# EAGLE design curveTracerRev4 (EAGLE 9.1.3)
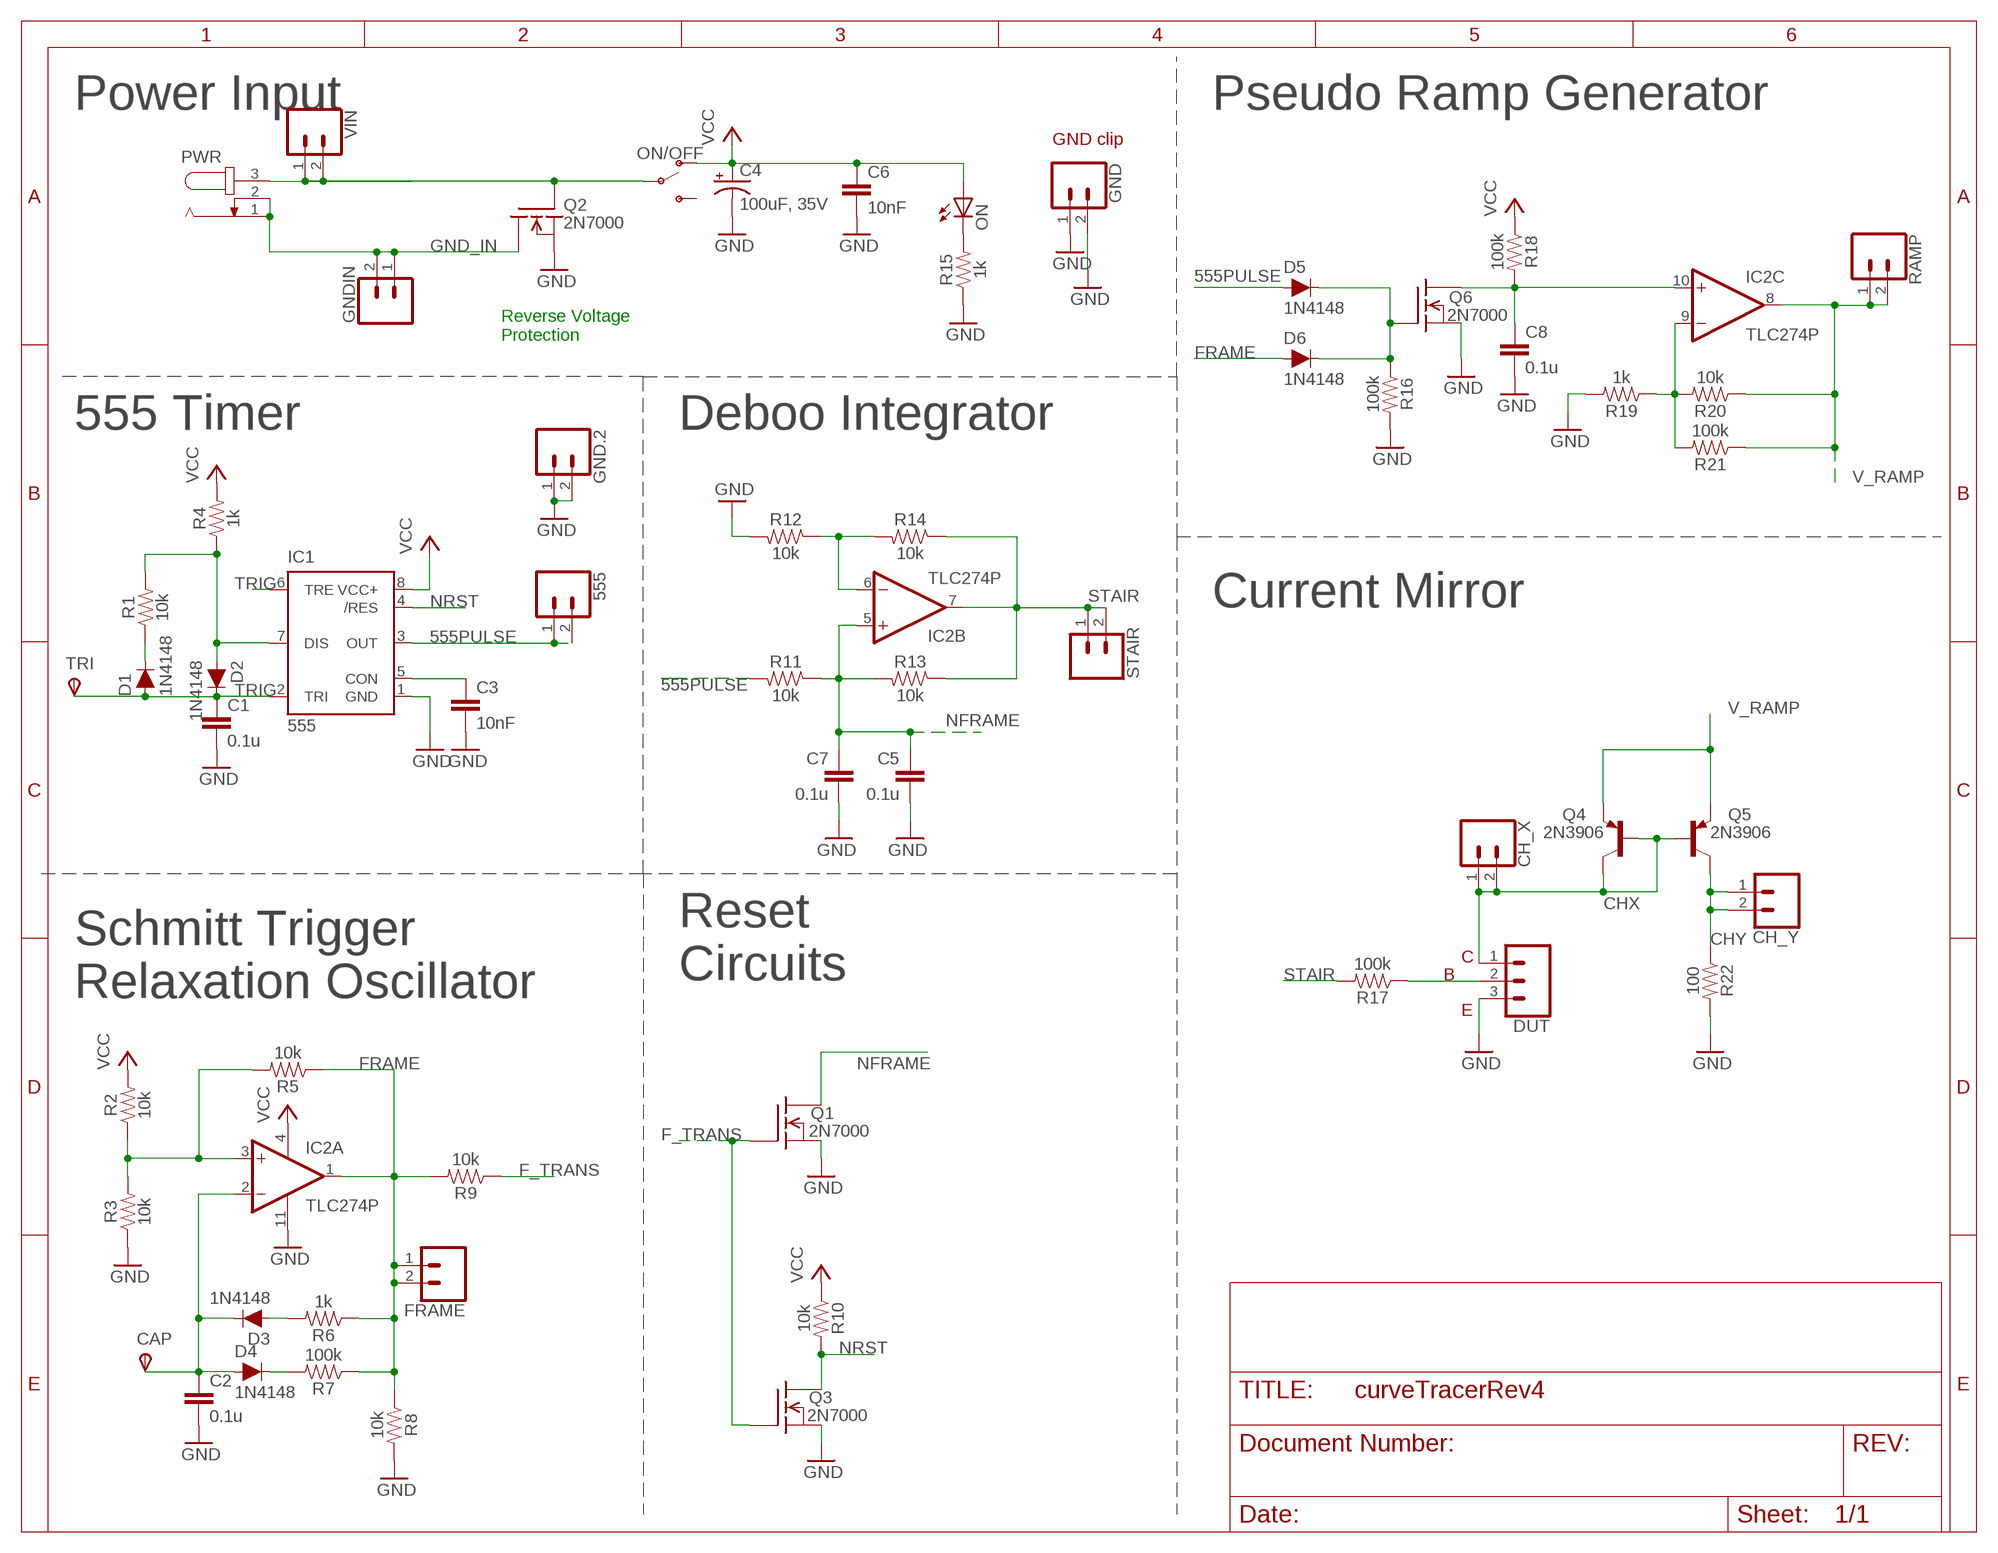
[diagram p0: schematic, sheet 1]

## Parts
555  CONN_02  [1X02]
C1  0.1u  C-EU050-024X044  [C050-024X044]
C2  0.1u  C-EU050-024X044  [C050-024X044]
C3  10nF  C-EU050-024X044  [C050-024X044]
C4  100uF, 35V  CPOL-USE2.5-6  [E2,5-6]
C5  0.1u  C-EU050-024X044  [C050-024X044]
C6  10nF  C-EU050-024X044  [C050-024X044]
C7  0.1u  C-EU050-024X044  [C050-024X044]
C8  0.1u  C-EU050-024X044  [C050-024X044]
CAP  TPSPAD1-13Y  [P1-13Y]
CH_X  CONN_02  [1X02]
CH_Y  CONN_02  [1X02]
D1  1N4148  DIODE-1N4148  [DIODE-1N4148]
D2  1N4148  DIODE-1N4148  [DIODE-1N4148]
D3  1N4148  DIODE-1N4148  [DIODE-1N4148]
D4  1N4148  DIODE-1N4148  [DIODE-1N4148]
D5  1N4148  DIODE-1N4148  [DIODE-1N4148]
D6  1N4148  DIODE-1N4148  [DIODE-1N4148]
DUT  CONN_03LOCK_LONGPADS  [1X03_LOCK_LONGPADS]
FRAME  CONN_02  [1X02]
GND  CONN_02  [1X02]
GND.2  CONN_02  [1X02]
GNDIN  CONN_02  [1X02]
IC1  555  555P  [DIP08]
IC2  TLC274P  [DIL14]
ON  LED5MM  [LED5MM]
ON/OFF  SWITCH-SPDT-PTH-11.6X4.0MM  [SWITCH_SPDT_PTH_11.6X4.0MM]
PWR  JACK-PLUG0  [SPC4077]
Q1  2N7000  TN0602N3  [TO-92]
Q2  2N7000  TN0602N3  [TO-92]
Q3  2N7000  TN0602N3  [TO-92]
Q4  2N3906  [TO92]
Q5  2N3906  [TO92]
Q6  2N7000  TN0602N3  [TO-92]
R1  10k  RESISTORAXIAL-0.3  [AXIAL-0.3]
R2  10k  RESISTORAXIAL-0.3  [AXIAL-0.3]
R3  10k  RESISTORAXIAL-0.3  [AXIAL-0.3]
R4  1k  RESISTORAXIAL-0.3  [AXIAL-0.3]
R5  10k  RESISTORAXIAL-0.3  [AXIAL-0.3]
R6  1k  RESISTORAXIAL-0.3  [AXIAL-0.3]
R7  100k  RESISTORAXIAL-0.3  [AXIAL-0.3]
R8  10k  RESISTORAXIAL-0.3  [AXIAL-0.3]
R9  10k  RESISTORAXIAL-0.3  [AXIAL-0.3]
R10  10k  RESISTORAXIAL-0.3  [AXIAL-0.3]
R11  10k  RESISTORAXIAL-0.3  [AXIAL-0.3]
R12  10k  RESISTORAXIAL-0.3  [AXIAL-0.3]
R13  10k  RESISTORAXIAL-0.3  [AXIAL-0.3]
R14  10k  RESISTORAXIAL-0.3  [AXIAL-0.3]
R15  1k  RESISTORAXIAL-0.3  [AXIAL-0.3]
R16  100k  RESISTORAXIAL-0.3  [AXIAL-0.3]
R17  100k  RESISTORAXIAL-0.3  [AXIAL-0.3]
R18  100k  RESISTORAXIAL-0.3  [AXIAL-0.3]
R19  1k  RESISTORAXIAL-0.3  [AXIAL-0.3]
R20  10k  RESISTORAXIAL-0.3  [AXIAL-0.3]
R21  100k  RESISTORAXIAL-0.3  [AXIAL-0.3]
R22  100  RESISTORAXIAL-0.3  [AXIAL-0.3]
RAMP  CONN_02  [1X02]
STAIR  CONN_02  [1X02]
TRI  TPSPAD1-13Y  [P1-13Y]
VIN  CONN_02  [1X02]

## Nets
555PULSE: 555.1 555.2 D5.A IC1.3(OUT) R11.P$2
CHX: CH_X.1 CH_X.2 DUT.1 Q4.1(C) Q4.2(B) Q5.2(B)
CHY: CH_Y.1 CH_Y.2 Q5.1(C) R22.P$1
F_TRANS: Q1.2(G) Q3.2(G) R9.P$1
FRAME: D6.A FRAME.1 FRAME.2 IC2.1(A:OUT) R5.P$1 R6.P$1 R7.P$1 R8.P$1 R9.P$2
GND: C1.2 C2.2 C3.2 C4.- C5.2 C6.2 C7.2 C8.2 DUT.3 GND.1 GND.2 GND.2.1 GND.2.2 IC1.1(GND) IC2.11(P:V-) Q1.1(S) Q2.1(S) Q3.1(S) Q6.1(S) R3.P$1 R8.P$2 R12.P$2 R15.P$1 R16.P$2 R19.P$2 R22.P$2
GND_IN: GNDIN.1 GNDIN.2 PWR.1 PWR.2 Q2.3(D)
N$1: ON/OFF.2(P) PWR.3 Q2.2(G) VIN.1 VIN.2
N$2: ON.K(C) R15.P$2
N$3: D1.C R1.P$1
N$5: D2.A IC1.7(DIS) R1.P$2 R4.P$1
N$6: D3.A R6.P$2
N$7: C3.1 IC1.5(CON)
N$8: C2.1 CAP.TP(PP) D3.C D4.A IC2.2(A:-IN)
N$9: IC2.3(A:+IN) R2.P$1 R3.P$2 R5.P$2
N$10: D4.C R7.P$2
N$12: D5.C D6.C Q6.2(G) R16.P$1
N$13: DUT.2 R17.P$1
N$15: IC2.6(B:-IN) R12.P$1 R14.P$2
N$16: IC2.9(C:-IN) R19.P$1 R20.P$2 R21.P$2
N$18: C8.1 IC2.10(C:+IN) Q6.3(D) R18.P$2
NFRAME: C5.1 C7.1 IC2.5(B:+IN) Q1.3(D) R11.P$1 R13.P$2
NRST: IC1.4(/RES) Q3.3(D) R10.P$2
STAIR: IC2.7(B:OUT) R13.P$1 R14.P$1 R17.P$2 STAIR.1 STAIR.2
TRIG: C1.1 D1.A D2.C IC1.2(TRI) IC1.6(TRE) TRI.TP(PP)
V_RAMP: IC2.8(C:OUT) Q4.3(E) Q5.3(E) R20.P$1 R21.P$1 RAMP.1 RAMP.2
VCC: C4.+ C6.1 IC1.8(VCC+) IC2.4(P:V+) ON.A ON/OFF.1(O) R2.P$2 R4.P$2 R10.P$1 R18.P$1
Unconnected: IC2.12(D:+IN) IC2.13(D:-IN) IC2.14(D:OUT) ON/OFF.3(S)

## Notes on the sheet
- Power Input | Pseudo Ramp Generator
- GND clip
- Reverse Voltage 
  Protection
- 555 Timer | Deboo Integrator
- Current Mirror
- C
- Reset 
  Circuits
- B
- Schmitt Trigger 
  Relaxation Oscillator
- E

## Library data of the parts
555 CH_X CH_Y FRAME GND GND.2 GNDIN RAMP STAIR VIN = SparkFun-Connectors:CONN_02: Multi connection point. Often used as Generic Header-pin footprint for 0.1 inch spaced/style header connections On any of the 0.1 inch spaced packages, you can populate with these: Break Away Headers - Straight <https://www.sparkfun.com/products/116> (PRT-00116) Break Away Male Headers - Right Angle <https://www.sparkfun.com/products/553> (PRT-00553) Female Headers <https://www.sparkfun.com/products/115> (PRT-00115) Break Away Headers - Machine Pin <https://www.sparkfun.com/products/117> (PRT-00117) Break Away Female Headers - Swiss Machine Pin <https://www.sparkfun.com/products/743> (PRT-00743) For SCREWTERMINALS and SPRING TERMINALS visit here: Screw Terimnals on SparkFun.com <https://www.sparkfun.com/search/results?term=Screw+Terminals> (5mm/3.5mm/2.54mm spacing) This device is also useful as a general connection point to wire up your design to another part of your project. Our various solder wires solder well into these plated through hole pads. Hook-Up Wire - Assortment (Stranded, 22 AWG) <https://www.sparkfun.com/products/11375> (PRT-11375) Hook-Up Wire - Assortment (Solid Core, 22 AWG) <https://www.sparkfun.com/products/11367> (PRT-11367) View the entire wire category on our website here <https://www.sparkfun.com/categories/141> Special notes: Molex polarized connector foot print use with: PRT-08233 with associated crimp pins and housings. 2.54_SCREWTERM for use with PRT-10571. 3.5mm Screw Terminal footprints for PRT-08084 5mm Screw Terminal footprints for use with PRT-08432
C1-C3 C5-C8 = rcl:C-EU: CAPACITOR, European symbol; SPICEPREFIX: C
C4 = rcl:CPOL-US: POLARIZED CAPACITOR, American symbol; SPICEPREFIX: C
CAP TRI = testpad:TPS: TEST PIN
D1-D6 = SparkFun-DiscreteSemi:DIODE: Diode These are standard reverse protection diodes and small signal diodes. SparkFun Products: SparkFun SparkPunk Sound Kit <https://www.sparkfun.com/products/11177> SparkFun ESP8266 Thing <https://www.sparkfun.com/products/13231>; PROD_ID: DIO-08378; VALUE: 200mA/100V/1V
DUT = SparkFun-Connectors:CONN_03: Multi connection point. Often used as Generic Header-pin footprint for 0.1 inch spaced/style header connections On any of the 0.1 inch spaced packages, you can populate with these: Break Away Headers - Straight <https://www.sparkfun.com/products/116> (PRT-00116) Break Away Male Headers - Right Angle <https://www.sparkfun.com/products/553> (PRT-00553) Female Headers <https://www.sparkfun.com/products/115> (PRT-00115) Break Away Headers - Machine Pin <https://www.sparkfun.com/products/117> (PRT-00117) Break Away Female Headers - Swiss Machine Pin <https://www.sparkfun.com/products/743> (PRT-00743) Stackable Header - 3 Pin (Female, 0.1") <https://www.sparkfun.com/products/13875> (PRT-13875) For SCREWTERMINALS and SPRING TERMINALS visit here: Screw Terimnals on SparkFun.com <https://www.sparkfun.com/search/results?term=Screw+Terminals> (5mm/3.5mm/2.54mm spacing) This device is also useful as a general connection point to wire up your design to another part of your project. Our various solder wires solder well into these plated through hole pads. Hook-Up Wire - Assortment (Stranded, 22 AWG) <https://www.sparkfun.com/products/11375> (PRT-11375) Hook-Up Wire - Assortment (Solid Core, 22 AWG) <https://www.sparkfun.com/products/11367> (PRT-11367) View the entire wire category on our website here <https://www.sparkfun.com/categories/141> Special notes: Molex polarized connector foot print use with SKU : PRT-08232 with associated crimp pins and housings.
IC1 = SparkFun-IC-Special-Function:555: General purpose bipolar Timer Datasheet <http://www.sparkfun.com/datasheets/Components/General/ne555.pdf> SparkFun Products SparkFun SparkPunk Sequencer Kit <https://www.sparkfun.com/products/12707> (KIT-12707) Storefront Component: 555 Timer <https://www.sparkfun.com/products/9273> (COM-09273) Two parts valid for production: VFP: IC-11930 (M7555 PTH) VFP: IC-09173 (555 PTH) - Preferred; PROD_ID: IC-09173; PROD_ID_ALT: IC-09173
IC2 = linear:TLC274: OP AMP
ON = led:LED: LED OSRAM: - CHIPLED LG R971, LG N971, LY N971, LG Q971, LY Q971, LO R971, LY R971 LH N974, LH R974 LS Q976, LO Q976, LY Q976 LO Q996 - Hyper CHIPLED LW Q18S LB Q993, LB Q99A, LB R99A - SideLED LS A670, LO A670, LY A670, LG A670, LP A670 LB A673, LV A673, LT A673, LW A673 LH A674 LY A675 LS A676, LA A676, LO A676, LY A676, LW A676 LS A679, LY A679, LG A679 - Hyper Micro SIDELED® LS Y876, LA Y876, LO Y876, LY Y876 LT Y87S - SmartLED LW L88C, LW L88S LB L89C, LB L89S, LG L890 LS L89K, LO L89K, LY L89K LS L896, LA L896, LO L896, LY L896 - TOPLED LS T670, LO T670, LY T670, LG T670, LP T670 LSG T670, LSP T670, LSY T670, LOP T670, LYG T670 LG T671, LOG T671, LSG T671 LB T673, LV T673, LT T673, LW T673 LH T674 LS T676, LA T676, LO T676, LY T676, LB T676, LH T676, LSB T676, LW T676 LB T67C, LV T67C, LT T67C, LS T67K, LO T67K, LY T67K, LW E67C LS E67B, LA E67B, LO E67B, LY E67B, LB E67C, LV E67C, LT E67C LW T67C LS T679, LY T679, LG T679 LS T770, LO T770, LY T770, LG T770, LP T770 LB T773, LV T773, LT T773, LW T773 LH T774 LS E675, LA E675, LY E675, LS T675 LS T776, LA T776, LO T776, LY T776, LB T776 LHGB T686 LT T68C, LB T68C - Hyper Mini TOPLED® LB M676 - Mini TOPLED Santana® LG M470 LS M47K, LO M47K, LY M47K Source: http://www.osram.convergy.de LUXEON: - LUMILED® LXK2-PW12-R00, LXK2-PW12-S00, LXK2-PW14-U00, LXK2-PW14-V00 LXK2-PM12-R00, LXK2-PM12-S00, LXK2-PM14-U00 LXK2-PE12-Q00, LXK2-PE12-R00, LXK2-PE12-S00, LXK2-PE14-T00, LXK2-PE14-U00 LXK2-PB12-K00, LXK2-PB12-L00, LXK2-PB12-M00, LXK2-PB14-N00, LXK2-PB14-P00, LXK2-PB14-Q00 LXK2-PR12-L00, LXK2-PR12-M00, LXK2-PR14-Q00, LXK2-PR14-R00 LXK2-PD12-Q00, LXK2-PD12-R00, LXK2-PD12-S00 LXK2-PH12-R00, LXK2-PH12-S00 LXK2-PL12-P00, LXK2-PL12-Q00, LXK2-PL12-R00 Source: www.luxeon.com KINGBRIGHT: KA-3528ASYC Source: www.kingbright.com
ON/OFF = SparkFun-Switches:SWITCH-SPDT: Single Pole, Double Throw (SPDT) Switch Single-pole, double-throw (SPDT) switch. Variant Overview SMD-AYZ0202 Surface Mount DPDT Switch <https://www.sparkfun.com/products/597> (COM-00597) Used on e.g. LilyPad Arduino USB - ATmega32U4 Board <https://www.sparkfun.com/products/12049> PTH-11.6X4.0MM SPDT Mini Power Switch <https://www.sparkfun.com/products/102> (COM-00102) Used on e.g. SparkFun Simon Says - Through-Hole Soldering Kit <https://www.sparkfun.com/products/10547> (KIT-10547) PTH-11.6X4.0MM-KIT KIT version of SPDT Mini Power Switch - Simplifies soldering by removing tStop of switch pins - only one side can be soldered. PTH-11.6X4.0MM-LOCK LOCK version of SPDT Mini Power Switch - Offset pins hold switch in place for easier soldering. SMD-RIGHT-ANGLE Surface Mount Right Angle Switch <https://www.sparkfun.com/products/10860> (COM-10860) Used on e.g. SparkFun ESP8266 Thing <https://www.sparkfun.com/products/13231>; PROD_ID: SWCH-08261; SF_SKU: COM-00102
PWR = con-jack:JACK-PLUG: DC POWER JACK Power Jack, DC, Right Angle, Through Hole, Rated 5A at 16VDC, PC Terminals Distributor: Farnell (www.Farnell.de) Drawing: 84N1161.pdf / 84N1162.pdf Manufacturer: SPC Technology (www.spctechnology.com) Type: SPC4077 / SPC 4078; OC_FARNELL: unknown; OC_NEWARK: unknown
Q1-Q3 Q6 = transistor-fet:TN0602N3: N-Channel Enhancement MOSFET 20V; 4A; 0,75Ohm
Q4 Q5 = transistor-pnp:2N3906: PNP Transistor
R1-R22 = SparkFun-Resistors:RESISTOR: Generic Resistor Package

## Board
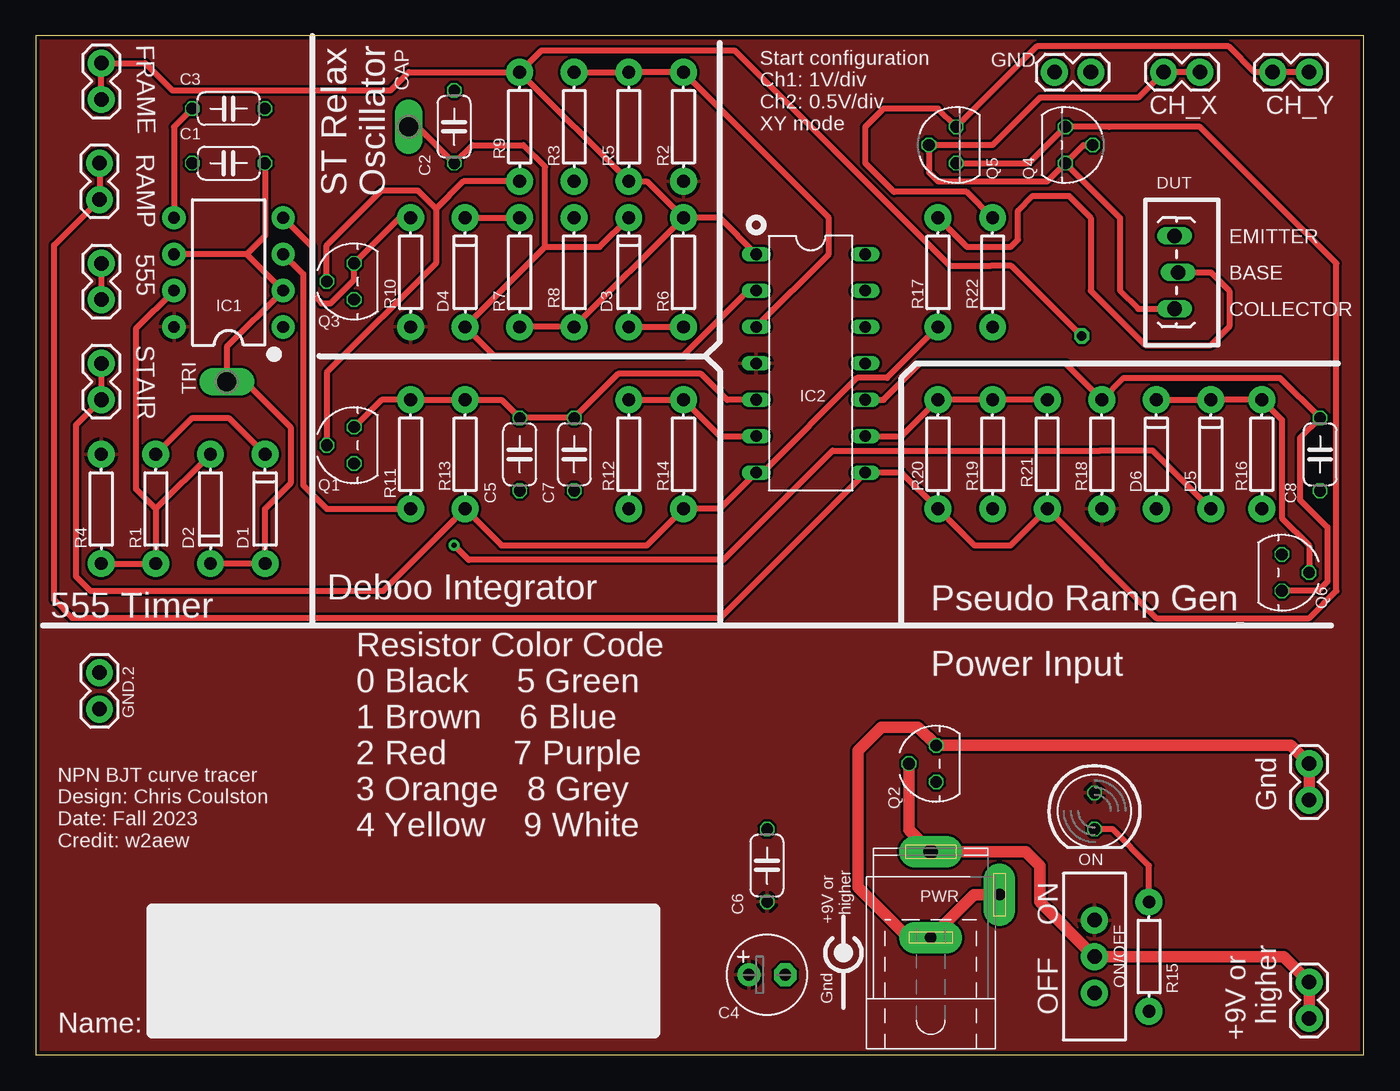
[diagram p1: board, top side]
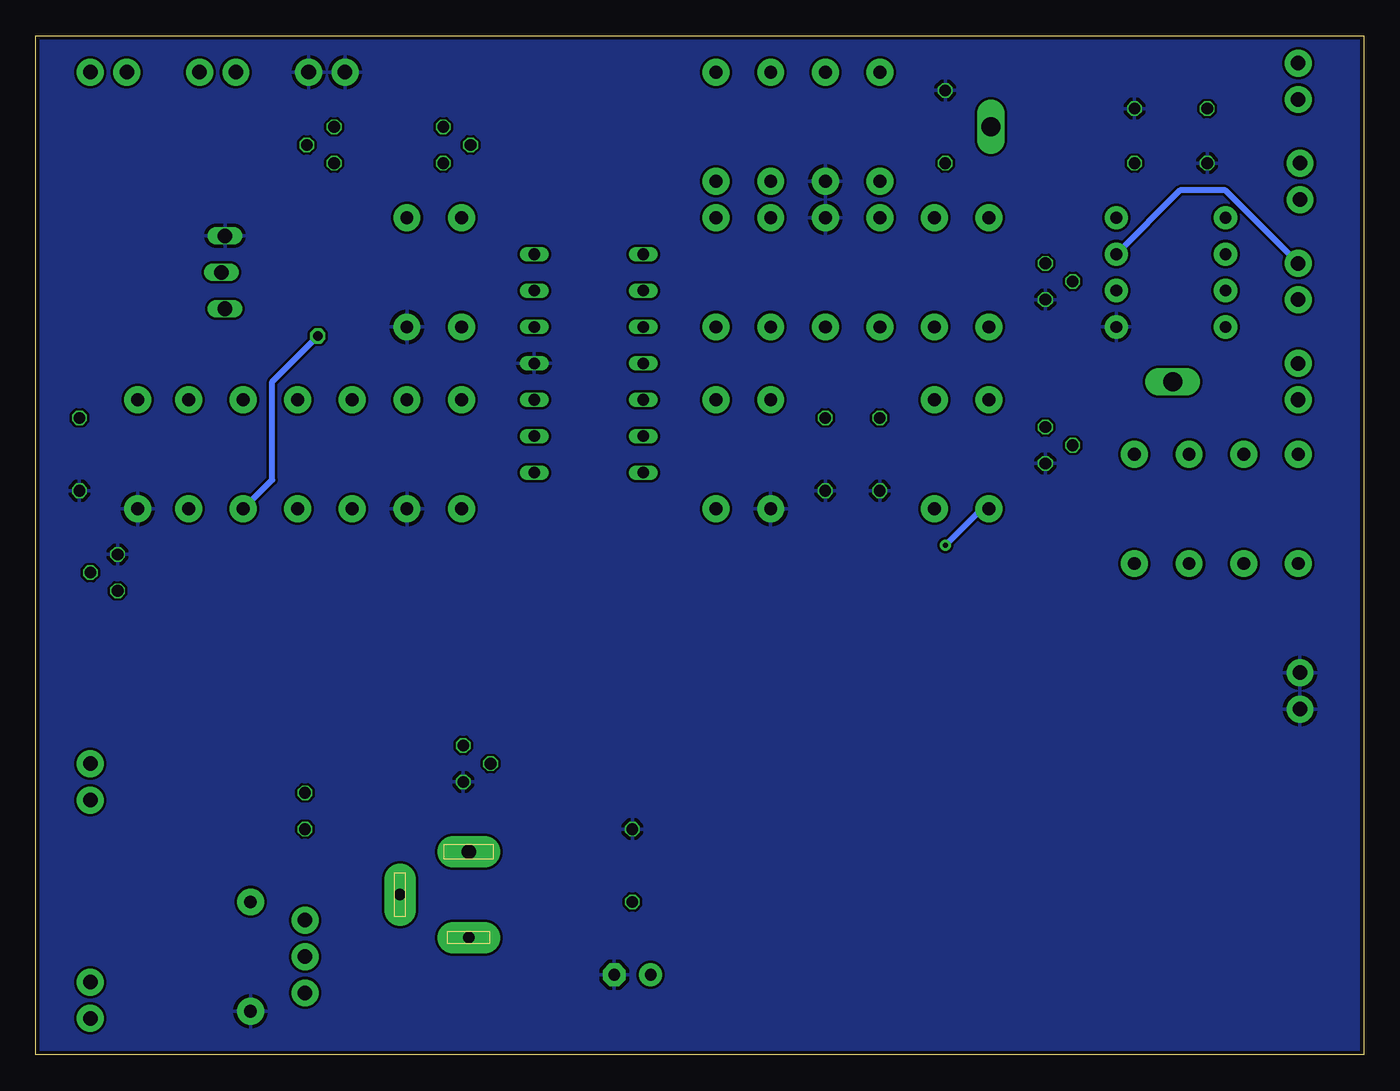
[diagram p2: board, bottom side, seen from below]

Size 92.71 x 71.12 mm. Coordinates in mm from the lower left corner, seen from the top.
Outline: 0,0 92.71,0 92.71,71.12 0,71.12 0,0
Copper layers (1*16): Top 0.0356mm / dielectric 1.5011mm / Bottom 0.0356mm
Design rules "SilverCircuits": minimum track width 7mil, minimum drill 10mil, track to track 7mil, track to pad 7mil, pad to pad 7mil, via to via 7mil, smd to smd 0mil, copper to edge 10mil, drill to drill 10mil, minimum pad ring 4mil, minimum via ring 8mil, stop-mask expansion 4mil, vias tented up to drill 0mil, thermal gap 10mil

### Footprints (pad centres in the part's own frame; a part is rotated, then mirrored left to right if it is on the bottom)
1X02 = drill 1.016 pad 1.88: 1 0,0; 2 2.54,0
C050-024X044 = drill 0.813 octagon: 1 -2.54,0; 2 2.54,0
E2,5-6 = drill 0.813 pad 1.6: + -1.27,0 | drill 0.813 pad 1.6 octagon: - 1.27,0
P1-13Y = drill 1.321 pad 1.905 long: TP 0,0
DIODE-1N4148 = drill 0.9 pad 1.88: A -3.81,0; C 3.81,0
1X03_LOCK_LONGPADS = drill 1.016 long: 1 0,0; 2 2.54,-0.254; 3 5.08,0
DIP08 = drill 0.813 pad 1.626: 1 -3.81,-3.81; 2 -1.27,-3.81; 3 1.27,-3.81; 4 3.81,-3.81; 5 3.81,3.81; 6 1.27,3.81; 7 -1.27,3.81; 8 -3.81,3.81
DIL14 = drill 0.813 long: 1 -7.62,-3.81; 2 -5.08,-3.81; 3 -2.54,-3.81; 4 0,-3.81; 5 2.54,-3.81; 6 5.08,-3.81; 7 7.62,-3.81; 8 7.62,3.81; 9 5.08,3.81; 10 2.54,3.81; 11 0,3.81; 12 -2.54,3.81; 13 -5.08,3.81; 14 -7.62,3.81
LED5MM = drill 0.813 octagon: A -1.27,0; K 1.27,0
SWITCH_SPDT_PTH_11.6X4.0MM = drill 1.016 pad 1.88: 1 0,2.54; 2 0,0; 3 0,-2.54
SPC4077 = drill 0.8 pad 2.184 long: 1 -3,0; 2 0,-4.8 | drill 1 pad 2.184 long: 3 3,0
TO-92 = drill 0.813 octagon: 1 -1.27,0; 2 0,1.905; 3 1.27,0
TO92 = drill 0.813 octagon: 1 1.27,0; 2 0,1.905; 3 -1.27,0
AXIAL-0.3 = drill 0.9 pad 1.88: P$1 -3.81,0; P$2 3.81,0

### Placement (x,y rotation side)
555  4.57,52.7 90 top
C1  13.46,62.23 180 top
C2  29.21,64.77 90 top
C3  13.46,66.04 0 top
C4  51.05,5.59 0 top
C5  33.78,41.91 270 top
C6  51.05,13.21 90 top
C7  37.59,41.91 270 top
C8  89.66,41.91 270 top
CAP  26.04,64.77 0 top
CH_X  78.74,68.58 0 top
CH_Y  86.36,68.58 0 top
D1  16,38.1 90 top
D2  12.19,38.1 270 top
D3  41.4,54.61 90 top
D4  29.97,54.61 90 top
D5  82.04,41.91 90 top
D6  78.23,41.91 90 top
DUT  79.5,52.07 90 top
FRAME  4.57,66.67 90 top
GND  71.12,68.58 0 top
GND.2  4.45,26.67 270 top
GNDIN  88.9,17.78 90 top
IC1  13.46,54.61 90 top
IC2  54.1,48.26 270 top
ON  73.91,17.02 270 top
ON/OFF  73.91,6.86 0 top
PWR  62.48,11.18 90 top
Q1  22.23,42.55 90 top
Q2  62.87,20.32 90 top
Q3  22.23,53.98 90 top
Q4  71.88,63.5 270 top
Q5  64.26,63.5 90 top
Q6  87,33.66 270 top
R1  8.38,38.1 270 top
R2  45.21,64.77 270 top
R3  37.59,64.77 90 top
R4  4.57,38.1 90 top
R5  41.4,64.77 90 top
R6  45.21,54.61 270 top
R7  33.78,54.61 90 top
R8  37.59,54.61 90 top
R9  33.78,64.77 90 top
R10  26.16,54.61 90 top
R11  26.16,41.91 270 top
R12  41.4,41.91 270 top
R13  29.97,41.91 90 top
R14  45.21,41.91 90 top
R15  77.72,6.86 90 top
R16  85.6,41.91 270 top
R17  62.99,54.61 270 top
R18  74.42,41.91 90 top
R19  66.8,41.91 270 top
R20  62.99,41.91 90 top
R21  70.61,41.91 90 top
R22  66.8,54.61 270 top
RAMP  4.45,62.23 270 top
STAIR  4.57,45.72 90 top
TRI  13.34,46.99 90 top
VIN  88.9,2.54 90 top

### Tracks (layer width: path | path; a pad name or v marks a point on that pad's centre or on a via)
555PULSE  (via drill 0.35)
  Top 0.406: v29.21,35.56 30.23,34.54 48.01,34.54 55.63,42.16 74.3,42.16 77.98,42.16 D5.A | 555.2 555.1 | R11.P$2 20.32,38.1 18.67,39.75 18.67,54.48 IC1.3
  Bottom 0.406: v29.21,35.56 26.67,38.1 R11.P$2 | 555.2 9.65,60.33 12.83,60.33 IC1.3
CHX
  Top 0.406: Q4.1 75.69,58.42 75.69,53.34 76.96,52.07 DUT.1 | Q4.1 73.15,63.5 Q4.2 | Q4.1 70.61,60.96 62.99,60.96 62.36,61.59 Q5.2 66.8,63.5 70.1,66.8 76.96,66.8 CH_X.1 CH_X.2
CHY
  Top 0.406: R22.P$1 65,60.22 59.92,60.22 57.91,62.23 57.91,64.77 59.18,66.04 62.99,66.04 Q5.1 69.88,70.38 83.29,70.38 85.09,68.58 CH_Y.1 CH_Y.2
F_TRANS
  Top 0.406: R9.P$1 29.84,60.96 27.94,59.05 | 27.94,59.05 26.67,60.33 24.13,60.33 20.32,56.52 Q3.2 | Q1.2 20.32,47.62 27.94,55.24 27.94,59.05
FRAME  (via drill 0.65)
  Top 0.406: IC2.1 47.75,58.42 R6.P$1 | R6.P$1 42.67,60.96 R5.P$1 R9.P$2 | R7.P$1 R8.P$1 R6.P$1 | FRAME.1 FRAME.2 7.62,69.22 9.53,67.31 24.77,67.31 26.04,68.58 R9.P$2 | R9.P$2 35.31,70.1 48.77,70.1 63.8,55.07 66.67,55.07 68.12,55.07 v73.03,50.16
  Bottom 0.406: D6.A 76.2,40.13 76.2,46.99 v73.03,50.16
GND
  pour Bottom: 0,0 92.71,0 92.71,71.12 0,71.12
GND_IN
  Top 0.813: PWR.2 65.48,11.18 PWR.1 60.91,8.18 57.4,11.68 57.4,21.21 59.05,22.86 61.59,22.86 Q2.3 87.63,21.59 GNDIN.2 GNDIN.1
N$1
  Top 0.813: VIN.1 VIN.2 87.12,6.86 ON/OFF.2 70.1,10.67 70.1,13.21 69.14,14.18 PWR.3 60.96,15.7 Q2.2
N$2
  Top 0.406: R15.P$2 77.72,13.21 75.18,15.75 ON.K
N$3
  Top 0.406: D1.C 13.46,44.45 10.92,44.45 R1.P$1
N$5
  Top 0.406: D2.A 8.38,38.1 | 8.38,38.1 R1.P$2 R4.P$1 | 8.38,38.1 6.99,39.5 6.99,50.67 IC1.7
N$6
  Top 0.406: D3.A R6.P$2
N$7
  Top 0.406: C3.1 9.65,64.77 IC1.5
N$8
  Top 0.406: IC2.2 49.73,53.34 45.21,48.82 31.95,48.82 D4.A 35.56,56.39 | 35.56,56.39 35.56,61.98 34.04,63.5 30.48,63.5 C2.1 26.67,64.77 CAP.TP | 35.56,56.39 39.37,56.39 D3.C
N$9
  Top 0.406: R3.P$2 R5.P$2 R2.P$1 55.37,58.42 55.37,55.88 IC2.3
N$10
  Top 0.406: D4.C R7.P$2
N$12
  Top 0.406: D6.C D5.C R16.P$1 87,44.32 87,37.47 88.9,35.56 Q6.2
N$13
  Top 0.406: DUT.2 82.04,54.61 83.31,53.34 83.31,50.8 82.04,49.53 77.47,49.53 73.66,53.34 73.66,58.42 72.14,59.94 69.6,59.94 68.58,58.93 68.58,56.9 68.07,56.39 65.02,56.39 R17.P$1
N$15
  Top 0.406: IC2.6 47.75,43.18 R14.P$2 R12.P$1
N$16
  Top 0.406: IC2.9 60.45,43.18 62.61,45.34 | 62.61,45.34 R20.P$2 | R20.P$2 R19.P$1 R21.P$2 | R20.P$2 62.61,45.34
N$18
  Top 0.406: IC2.10 59.18,45.72 61.72,48.26 71.88,48.26 R18.P$2 75.95,47.24 86.87,47.24 C8.1 88.27,43.05 | 88.27,43.05 | 88.27,43.05 88.27,38.73 90.17,36.83 90.17,33.02 89.53,32.38 Q6.3
NFRAME
  Top 0.406: IC2.5 48.26,45.72 46.46,47.52 40.66,47.52 C7.1 C5.1 32.51,45.72 R13.P$2 R11.P$1 24.13,45.72 Q1.3
NRST
  Top 0.406: R10.P$2 25.4,58.42 Q3.3 22.23,54.1 20.57,52.45 19.94,52.45 19.3,53.09 19.3,56.39 | IC1.4 19.11,56.58 | 19.11,56.58 19.3,56.39 | 19.11,56.58 19.3,56.39
STAIR
  Top 0.406: R17.P$2 59.44,47.24 57.34,47.24 50.73,40.64 IC2.7 47.75,38.1 R14.P$1 42.67,35.56 32.51,35.56 R13.P$1 24.26,32.38 3.81,32.38 2.79,33.4 2.79,43.94 STAIR.1 STAIR.2
TRIG
  Top 0.406: 14.73,55.88 IC1.6 | D2.C D1.A 16,38.1 17.78,39.88 17.78,43.81 14.61,46.99 TRI.TP 13.34,49.4 IC1.2 14.73,55.88 | 14.73,55.88 16,57.15 C1.1
V_RAMP
  Top 0.406: Q5.3 69.34,62.23 Q4.3 74.93,64.77 81.28,64.77 90.81,55.24 90.81,32.38 88.9,30.48 78.23,30.48 R21.P$1 68.07,35.56 65.53,35.56 R20.P$1 60.45,40.64 IC2.8 47.75,30.48 2.54,30.48 1.27,31.75 1.27,56.52 RAMP.2 RAMP.1
VCC
  pour Top: 0,0 92.71,0 92.71,71.12 0,71.12

### Text on the board
tPlace: Start configuration / Ch1: 1V/div / Ch2: 0.5V/div / XY mode | ST Relax / Oscillator | EMITTER | BASE | COLLECTOR | Deboo Integrator | Pseudo Ramp Gen | 555 Timer | Power Input | Gnd | Resistor Color Code / 0 Black 5 Green / 1 Brown 6 Blue / 2 Red 7 Purple / 3 Orange 8 Grey / 4 Yellow 9 White | NPN BJT curve tracer / Design: Chris Coulston / Date: Fall 2023 / Credit: w2aew | +9V or / higher | Gnd | OFF ON | Name: | +9V or / higher